# EAGLE schematic Peliminary board (EAGLE 9.2.2)
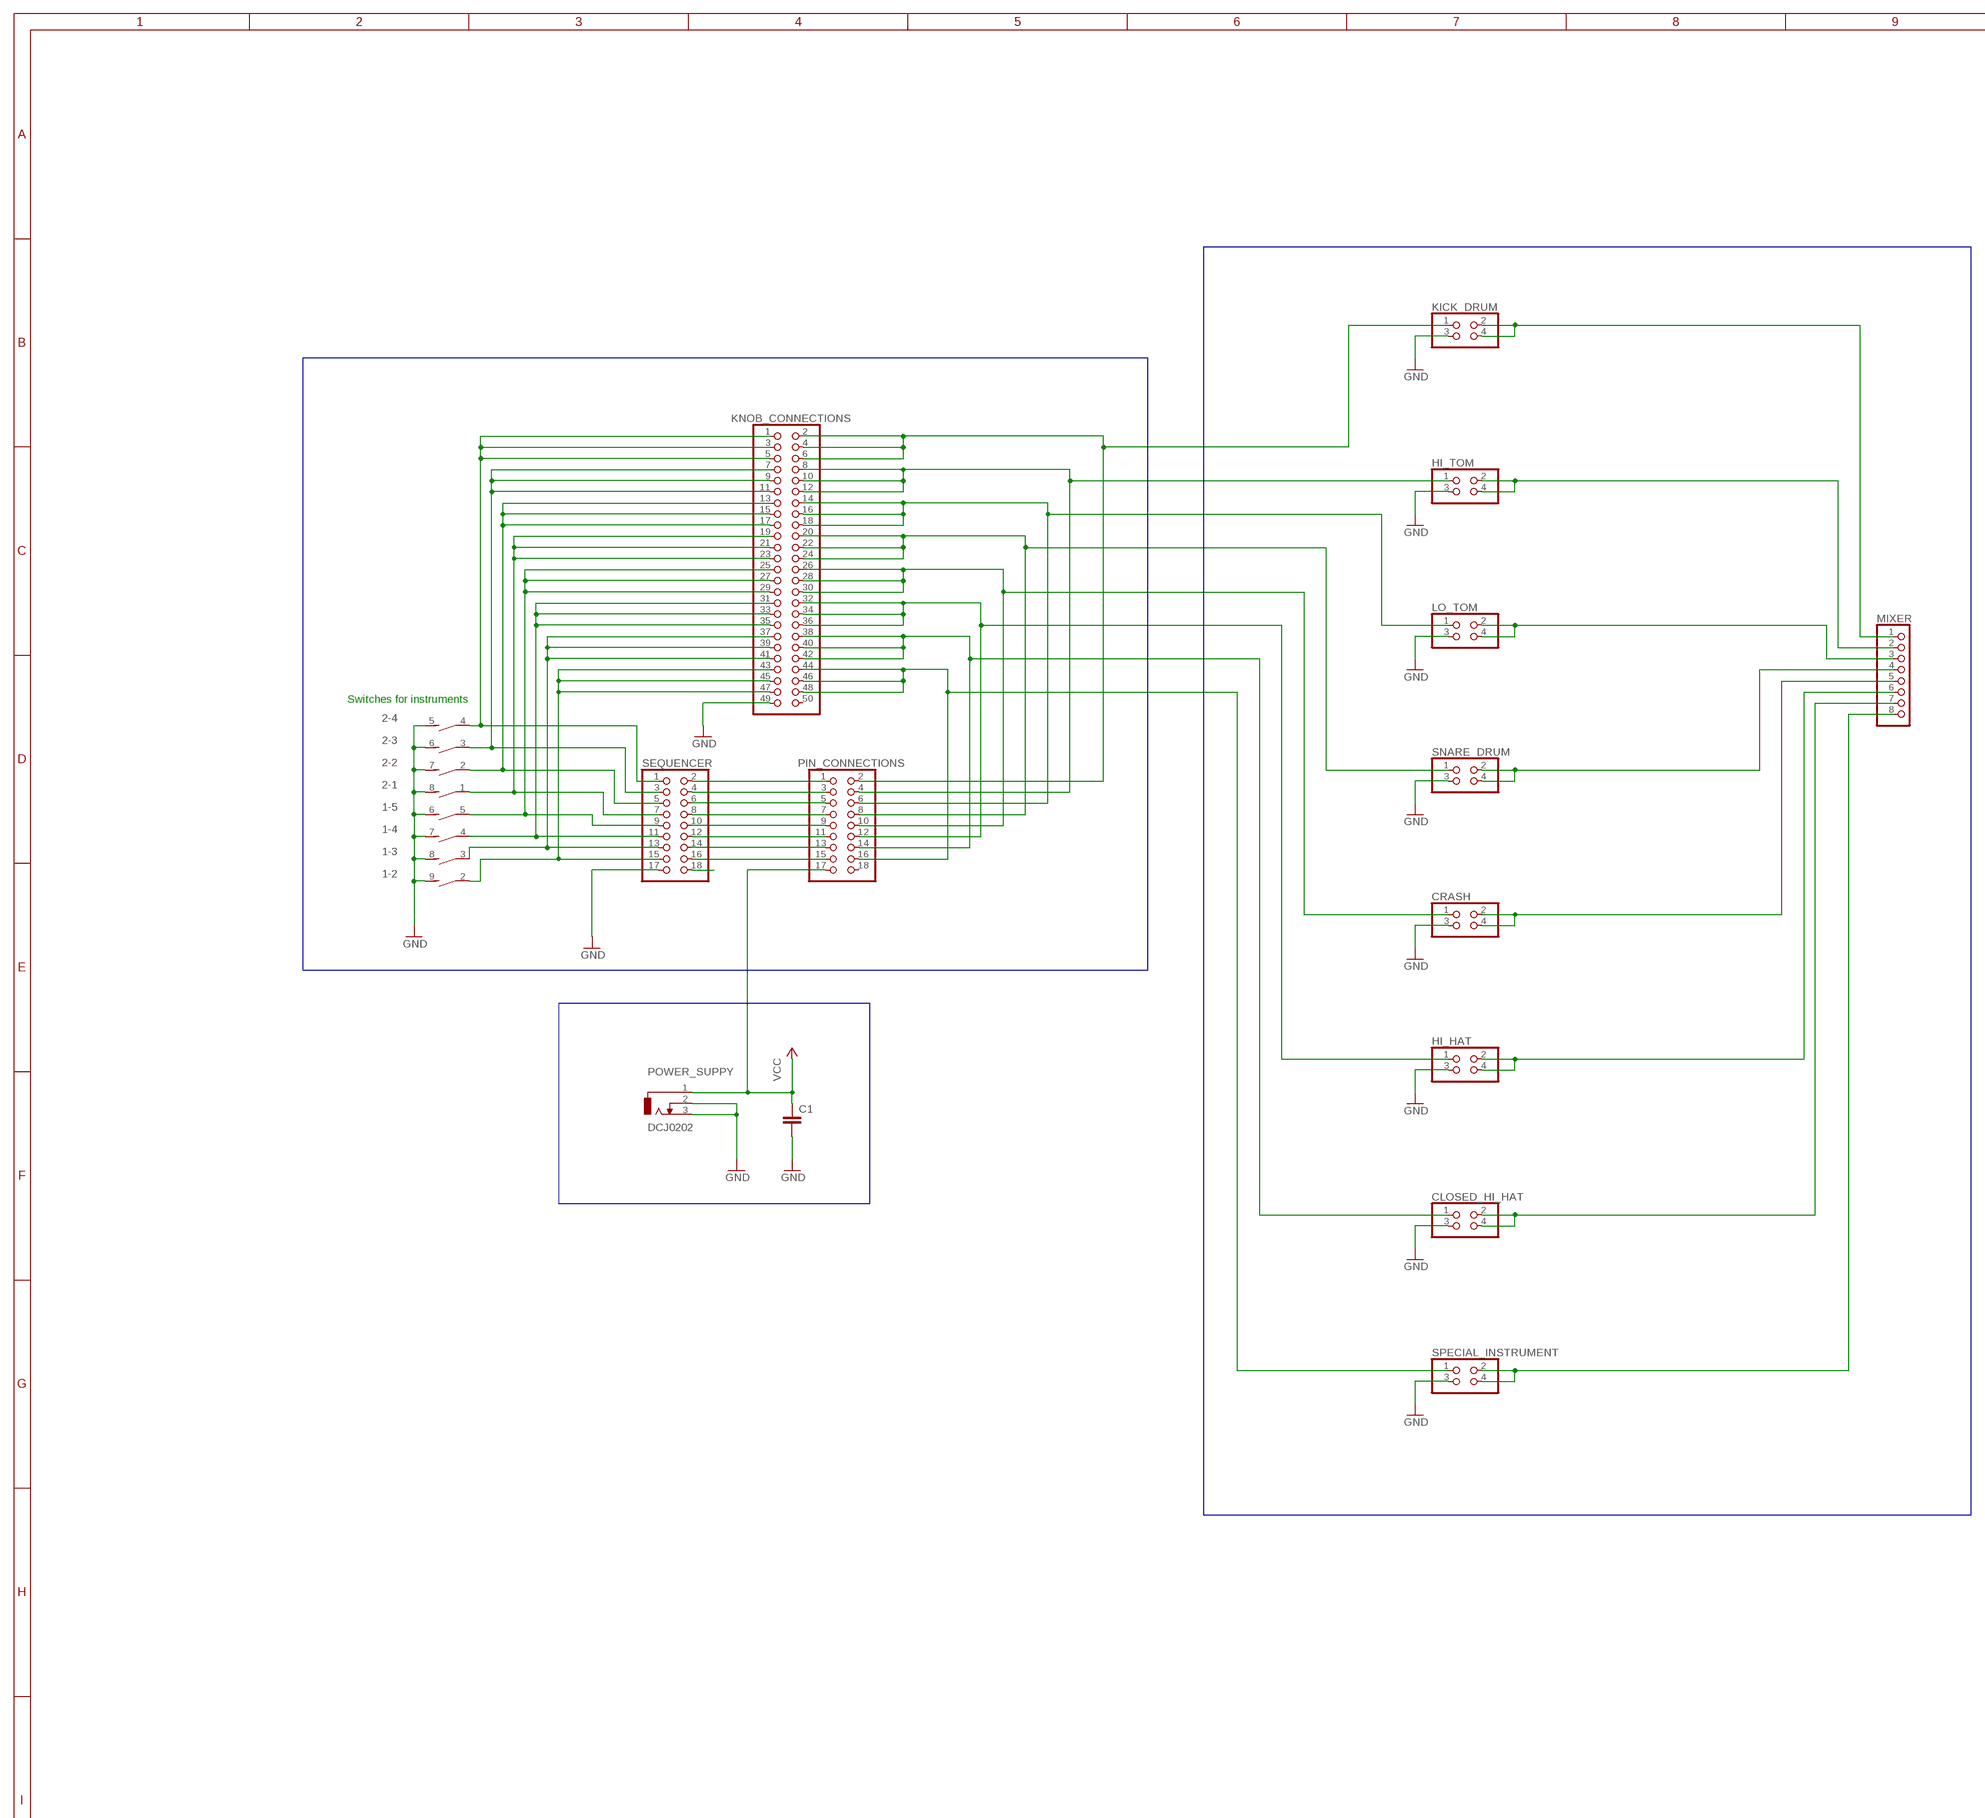
[diagram p0: schematic, sheet 1, part 1 of 2]
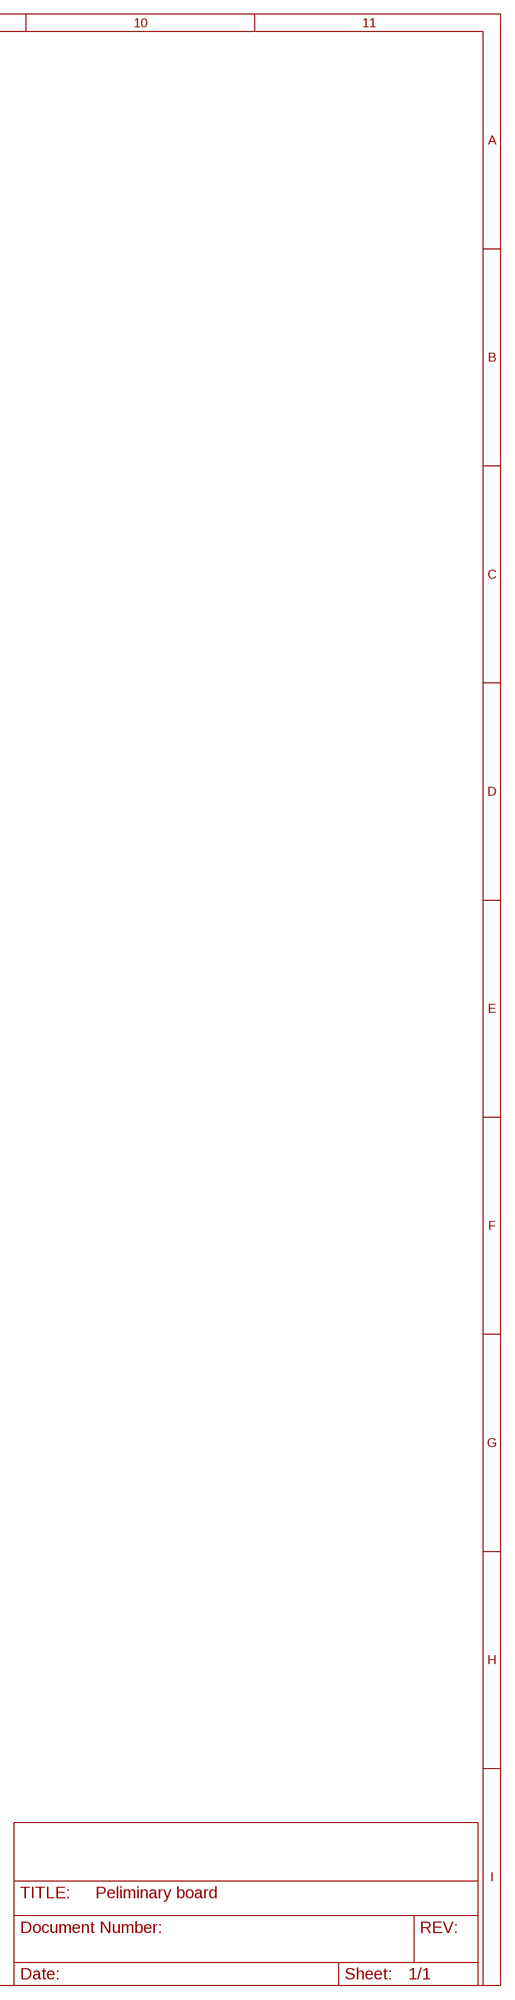
[diagram p1: schematic, sheet 1, part 2 of 2]

## Parts
1  DS05E  [DS-05]
2  DIP04S  [DIP04S]
C1  C2,5-3  [C2.5-3]
CLOSED_HI_HAT  PINHD-2X2  [2X02]
CRASH  PINHD-2X2  [2X02]
HI_HAT  PINHD-2X2  [2X02]
HI_TOM  PINHD-2X2  [2X02]
KICK_DRUM  PINHD-2X2  [2X02]
KNOB_CONNECTIONS  PINHD-2X25  [2X25]
LO_TOM  PINHD-2X2  [2X02]
MIXER  PINHD-1X8  [1X08]
PIN_CONNECTIONS  PINHD-2X9  [2X09]
POWER_SUPPY  DCJ0202  [DCJ0202]
SEQUENCER  PINHD-2X9  [2X09]
SNARE_DRUM  PINHD-2X2  [2X02]
SPECIAL_INSTRUMENT  PINHD-2X2  [2X02]

## Nets
GND: 1.6 1.7 1.8 1.9 2.5 2.6 2.7 2.8 C1.2 CLOSED_HI_HAT.3 CRASH.3 HI_HAT.3 HI_TOM.3 KICK_DRUM.3 KNOB_CONNECTIONS.49 LO_TOM.3 POWER_SUPPY.2 POWER_SUPPY.3 SEQUENCER.17 SNARE_DRUM.3 SPECIAL_INSTRUMENT.3
N$1: 2.3 KNOB_CONNECTIONS.7 KNOB_CONNECTIONS.9 KNOB_CONNECTIONS.11 SEQUENCER.3
N$2: 2.1 KNOB_CONNECTIONS.19 KNOB_CONNECTIONS.21 KNOB_CONNECTIONS.23 SEQUENCER.7
N$3: 1.5 KNOB_CONNECTIONS.25 KNOB_CONNECTIONS.27 KNOB_CONNECTIONS.29 SEQUENCER.9
N$4: 1.4 KNOB_CONNECTIONS.31 KNOB_CONNECTIONS.33 KNOB_CONNECTIONS.35 SEQUENCER.11
N$5: 1.3 KNOB_CONNECTIONS.37 KNOB_CONNECTIONS.39 KNOB_CONNECTIONS.41 SEQUENCER.13
N$6: KNOB_CONNECTIONS.14 KNOB_CONNECTIONS.16 KNOB_CONNECTIONS.18 LO_TOM.1 PIN_CONNECTIONS.6
N$8: 2.4 KNOB_CONNECTIONS.1 KNOB_CONNECTIONS.3 KNOB_CONNECTIONS.5 SEQUENCER.1
N$9: PIN_CONNECTIONS.1 SEQUENCER.2
N$10: 1.2 KNOB_CONNECTIONS.43 KNOB_CONNECTIONS.45 KNOB_CONNECTIONS.47 SEQUENCER.15
N$11: PIN_CONNECTIONS.3 SEQUENCER.4
N$12: PIN_CONNECTIONS.5 SEQUENCER.6
N$13: KNOB_CONNECTIONS.20 KNOB_CONNECTIONS.22 KNOB_CONNECTIONS.24 PIN_CONNECTIONS.8 SNARE_DRUM.1
N$14: HI_TOM.1 KNOB_CONNECTIONS.8 KNOB_CONNECTIONS.10 KNOB_CONNECTIONS.12 PIN_CONNECTIONS.4
N$15: PIN_CONNECTIONS.7 SEQUENCER.8
N$16: PIN_CONNECTIONS.9 SEQUENCER.10
N$17: PIN_CONNECTIONS.11 SEQUENCER.12
N$18: PIN_CONNECTIONS.13 SEQUENCER.14
N$19: PIN_CONNECTIONS.15 SEQUENCER.16
N$22: 2.2 KNOB_CONNECTIONS.13 KNOB_CONNECTIONS.15 KNOB_CONNECTIONS.17 SEQUENCER.5
N$23: CRASH.1 KNOB_CONNECTIONS.26 KNOB_CONNECTIONS.28 KNOB_CONNECTIONS.30 PIN_CONNECTIONS.10
N$24: HI_HAT.1 KNOB_CONNECTIONS.32 KNOB_CONNECTIONS.34 KNOB_CONNECTIONS.36 PIN_CONNECTIONS.12
N$25: KICK_DRUM.1 KNOB_CONNECTIONS.2 KNOB_CONNECTIONS.4 KNOB_CONNECTIONS.6 PIN_CONNECTIONS.2
N$26: KICK_DRUM.2 KICK_DRUM.4 MIXER.1
N$27: HI_TOM.2 HI_TOM.4 MIXER.2
N$28: CLOSED_HI_HAT.1 KNOB_CONNECTIONS.38 KNOB_CONNECTIONS.40 KNOB_CONNECTIONS.42 PIN_CONNECTIONS.14
N$29: KNOB_CONNECTIONS.44 KNOB_CONNECTIONS.46 KNOB_CONNECTIONS.48 PIN_CONNECTIONS.16 SPECIAL_INSTRUMENT.1
N$30: LO_TOM.2 LO_TOM.4 MIXER.3
N$32: MIXER.4 SNARE_DRUM.2 SNARE_DRUM.4
N$33: CRASH.2 CRASH.4 MIXER.5
N$34: HI_HAT.2 HI_HAT.4 MIXER.6
N$35: CLOSED_HI_HAT.2 CLOSED_HI_HAT.4 MIXER.7
N$36: MIXER.8 SPECIAL_INSTRUMENT.2 SPECIAL_INSTRUMENT.4
VCC: C1.1 PIN_CONNECTIONS.17 POWER_SUPPY.1
X: SEQUENCER.18
Unconnected: 1.1 1.10 KNOB_CONNECTIONS.50 PIN_CONNECTIONS.18

## Buses
B$1
B$2
B$3

## Notes on the sheet
- Switches for instruments

## Library data of the parts
1 = switch-dil:DS05E: DIL/CODE SWITCH; OC_FARNELL: unknown; OC_NEWARK: unknown
2 = switch-dil:DIP04S: DIL/CODE SWITCH; OC_FARNELL: unknown; OC_NEWARK: unknown
C1 = capacitor-wima:C: CAPACITOR naming: grid - package width
CLOSED_HI_HAT CRASH HI_HAT HI_TOM KICK_DRUM LO_TOM SNARE_DRUM SPECIAL_INSTRUMENT = pinhead:PINHD-2X2: PIN HEADER
KNOB_CONNECTIONS = pinhead:PINHD-2X25: PIN HEADER
MIXER = pinhead:PINHD-1X8: PIN HEADER
PIN_CONNECTIONS SEQUENCER = pinhead:PINHD-2X9: PIN HEADER
POWER_SUPPY = con-jack:DCJ0202: DC POWER JACK Source: DCJ0202.pdf; OC_FARNELL: unknown; OC_NEWARK: unknown